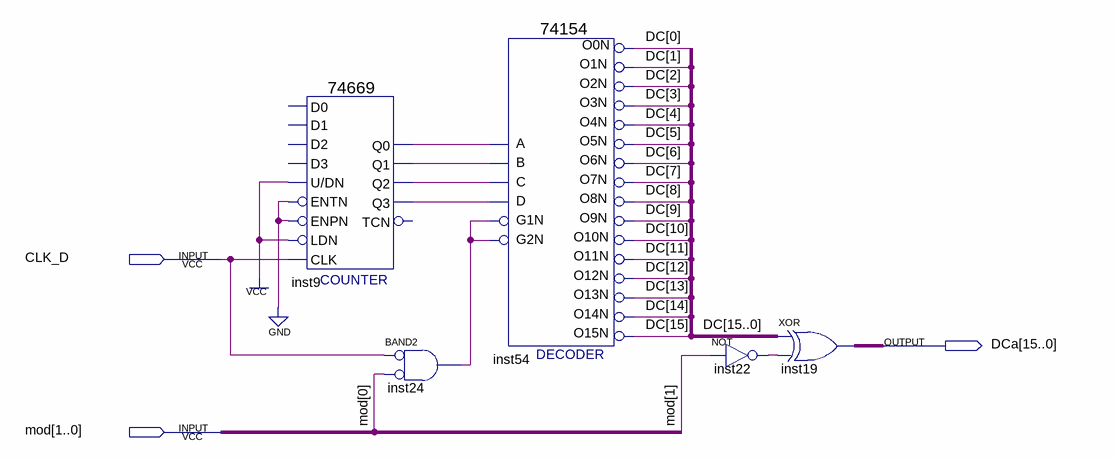
[diagram p0: schematic sheet]
// Quartus schematic block3.bdf as structural Verilog: 5 symbols, 3 pins
module block3 (
  input  CLK_D,
  input  [1:0] mod,
  output [15:0] DCa
);

  wire inst9_q0, inst9_q1, inst9_q2, inst9_q3, inst22_out, inst24_out;
  wire [15:0] DC;

  \74669  inst9 (
    .\U/DN (1'b1), .ENTN(1'b0), .LDN(1'b1), .CLK(CLK_D), .ENPN(1'b0), .Q2(inst9_q2), .Q3(inst9_q3),
    .Q1(inst9_q1), .Q0(inst9_q0));  // open: D1, D3, D2, D0, TCN
  and inst24 (inst24_out, ~CLK_D, ~mod[0]);  // BAND2
  \74154  inst54 (
    .C(inst9_q2), .D(inst9_q3), .B(inst9_q1), .A(inst9_q0), .G1N(inst24_out), .G2N(inst24_out), .O0N(DC[0]),
    .O12N(DC[12]), .O15N(DC[15]), .O10N(DC[10]), .O11N(DC[11]), .O1N(DC[1]), .O13N(DC[13]), .O14N(DC[14]),
    .O4N(DC[4]), .O3N(DC[3]), .O2N(DC[2]), .O7N(DC[7]), .O6N(DC[6]), .O5N(DC[5]), .O9N(DC[9]), .O8N(DC[8]));
  not inst22 (inst22_out, mod[1]);
  assign DCa = DC ^ {16{inst22_out}};  // XOR inst19, 16 bits wide
endmodule
